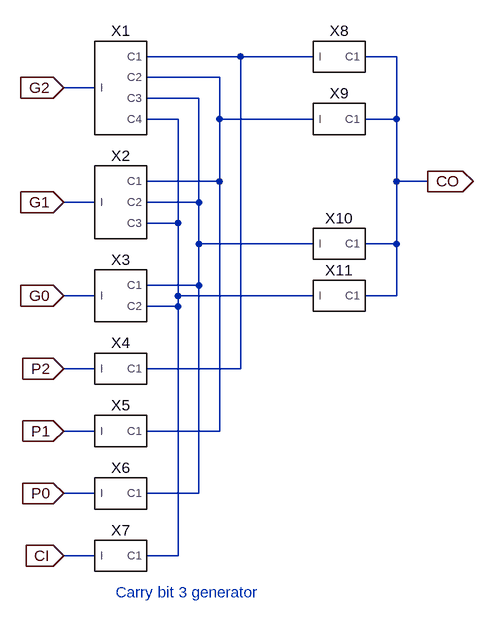
[diagram p0: schematic cla3.asc]
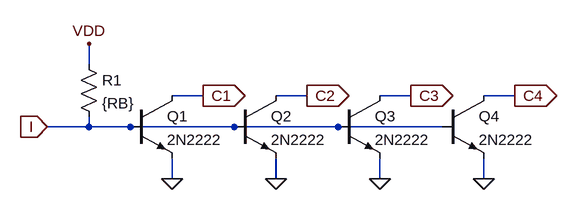
[diagram p1: sub-circuit iilg4.asc]
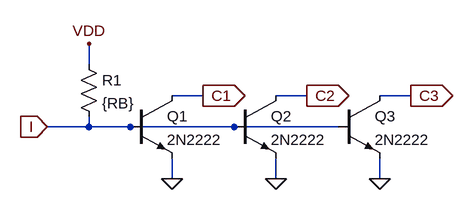
[diagram p2: sub-circuit iilg3.asc]
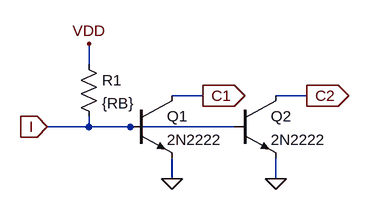
[diagram p3: sub-circuit iilg2.asc]
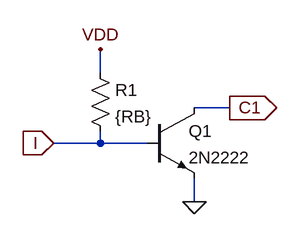
[diagram p4: sub-circuit iilg1.asc]
cla3.asc, the LTspice schematic file:
Version 4
SHEET 1 1200 840
WIRE 432 0 288 0
WIRE 544 0 432 0
WIRE 672 0 624 0
WIRE 400 32 288 32
WIRE 208 48 160 48
WIRE 368 64 288 64
WIRE 336 96 288 96
WIRE 400 96 400 32
WIRE 544 96 400 96
WIRE 672 96 672 0
WIRE 672 96 624 96
WIRE 400 192 400 96
WIRE 400 192 288 192
WIRE 672 192 672 96
WIRE 720 192 672 192
WIRE 208 224 160 224
WIRE 368 224 368 64
WIRE 368 224 288 224
WIRE 336 256 336 96
WIRE 336 256 288 256
WIRE 368 288 368 224
WIRE 544 288 368 288
WIRE 672 288 672 192
WIRE 672 288 624 288
WIRE 368 352 368 288
WIRE 368 352 288 352
WIRE 208 368 160 368
WIRE 336 368 336 256
WIRE 544 368 336 368
WIRE 672 368 672 288
WIRE 672 368 624 368
WIRE 336 384 336 368
WIRE 336 384 288 384
WIRE 208 480 160 480
WIRE 432 480 432 0
WIRE 432 480 288 480
WIRE 208 576 160 576
WIRE 400 576 400 192
WIRE 400 576 288 576
WIRE 208 672 160 672
WIRE 368 672 368 352
WIRE 368 672 288 672
WIRE 208 768 160 768
WIRE 336 768 336 384
WIRE 336 768 288 768
FLAG 160 48 G2
IOPIN 160 48 In
FLAG 160 224 G1
IOPIN 160 224 In
FLAG 160 368 G0
IOPIN 160 368 In
FLAG 160 480 P2
IOPIN 160 480 In
FLAG 160 576 P1
IOPIN 160 576 In
FLAG 160 672 P0
IOPIN 160 672 In
FLAG 160 768 CI
IOPIN 160 768 In
FLAG 720 192 CO
IOPIN 720 192 Out
SYMBOL iilg4 240 48 R0
SYMATTR InstName X1
SYMBOL iilg3 240 224 R0
SYMATTR InstName X2
SYMBOL iilg2 240 368 R0
SYMATTR InstName X3
SYMBOL iilg1 240 480 R0
SYMATTR InstName X4
SYMBOL iilg1 240 576 R0
SYMATTR InstName X5
SYMBOL iilg1 240 672 R0
SYMATTR InstName X6
SYMBOL iilg1 240 768 R0
SYMATTR InstName X7
SYMBOL iilg1 576 0 R0
SYMATTR InstName X8
SYMBOL iilg1 576 96 R0
SYMATTR InstName X9
SYMBOL iilg1 576 288 R0
SYMATTR InstName X10
SYMBOL iilg1 576 368 R0
SYMATTR InstName X11
TEXT 240 824 Left 2 ;Carry bit 3 generator

iilg4.asc, the sub-circuit schematic file:
Version 4
SHEET 1 1132 680
WIRE 384 240 384 208
WIRE 560 288 512 288
WIRE 720 288 672 288
WIRE 880 288 832 288
WIRE 1040 288 992 288
WIRE 384 336 384 320
WIRE 384 336 320 336
WIRE 448 336 384 336
WIRE 608 336 448 336
WIRE 768 336 608 336
WIRE 928 336 768 336
WIRE 512 416 512 384
WIRE 672 416 672 384
WIRE 832 416 832 384
WIRE 992 416 992 384
FLAG 384 208 VDD
FLAG 320 336 I
IOPIN 320 336 In
FLAG 512 416 0
FLAG 560 288 C1
IOPIN 560 288 Out
FLAG 672 416 0
FLAG 720 288 C2
IOPIN 720 288 Out
FLAG 832 416 0
FLAG 880 288 C3
IOPIN 880 288 Out
FLAG 992 416 0
FLAG 1040 288 C4
IOPIN 1040 288 Out
SYMBOL npn 448 288 R0
SYMATTR InstName Q1
SYMATTR Value 2N2222
SYMBOL res 368 224 R0
SYMATTR InstName R1
SYMATTR Value {RB}
SYMBOL npn 608 288 R0
SYMATTR InstName Q2
SYMATTR Value 2N2222
SYMBOL npn 768 288 R0
SYMATTR InstName Q3
SYMATTR Value 2N2222
SYMBOL npn 928 288 R0
SYMATTR InstName Q4
SYMATTR Value 2N2222

iilg3.asc, the sub-circuit schematic file:
Version 4
SHEET 1 956 680
WIRE 384 240 384 208
WIRE 560 288 512 288
WIRE 720 288 672 288
WIRE 880 288 832 288
WIRE 384 336 384 320
WIRE 384 336 320 336
WIRE 448 336 384 336
WIRE 608 336 448 336
WIRE 768 336 608 336
WIRE 512 416 512 384
WIRE 672 416 672 384
WIRE 832 416 832 384
FLAG 384 208 VDD
FLAG 320 336 I
IOPIN 320 336 In
FLAG 512 416 0
FLAG 560 288 C1
IOPIN 560 288 Out
FLAG 672 416 0
FLAG 720 288 C2
IOPIN 720 288 Out
FLAG 832 416 0
FLAG 880 288 C3
IOPIN 880 288 Out
SYMBOL npn 448 288 R0
SYMATTR InstName Q1
SYMATTR Value 2N2222
SYMBOL res 368 224 R0
SYMATTR InstName R1
SYMATTR Value {RB}
SYMBOL npn 608 288 R0
SYMATTR InstName Q2
SYMATTR Value 2N2222
SYMBOL npn 768 288 R0
SYMATTR InstName Q3
SYMATTR Value 2N2222

iilg2.asc, the sub-circuit schematic file:
Version 4
SHEET 1 880 680
WIRE 384 240 384 208
WIRE 560 288 512 288
WIRE 720 288 672 288
WIRE 384 336 384 320
WIRE 384 336 320 336
WIRE 448 336 384 336
WIRE 608 336 448 336
WIRE 512 416 512 384
WIRE 672 416 672 384
FLAG 384 208 VDD
FLAG 320 336 I
IOPIN 320 336 In
FLAG 512 416 0
FLAG 560 288 C1
IOPIN 560 288 Out
FLAG 672 416 0
FLAG 720 288 C2
IOPIN 720 288 Out
SYMBOL npn 448 288 R0
SYMATTR InstName Q1
SYMATTR Value 2N2222
SYMBOL res 368 224 R0
SYMATTR InstName R1
SYMATTR Value {RB}
SYMBOL npn 608 288 R0
SYMATTR InstName Q2
SYMATTR Value 2N2222

iilg1.asc, the sub-circuit schematic file:
Version 4
SHEET 1 880 680
WIRE 384 240 384 208
WIRE 560 288 512 288
WIRE 384 336 384 320
WIRE 384 336 320 336
WIRE 448 336 384 336
WIRE 512 416 512 384
FLAG 512 416 0
FLAG 384 208 VDD
FLAG 320 336 I
IOPIN 320 336 In
FLAG 560 288 C1
IOPIN 560 288 Out
SYMBOL npn 448 288 R0
SYMATTR InstName Q1
SYMATTR Value 2N2222
SYMBOL res 368 224 R0
SYMATTR InstName R1
SYMATTR Value {RB}

The netlist it stands for:
* cla3.asc
XX1 G2 N001 N002 N003 N004 iilg4
XX2 G1 N002 N003 N004 iilg3
XX3 G0 N003 N004 iilg2
XX4 P2 N001 iilg1
XX5 P1 N002 iilg1
XX6 P0 N003 iilg1
XX7 CI N004 iilg1
XX8 N001 CO iilg1
XX9 N002 CO iilg1
XX10 N003 CO iilg1
XX11 N004 CO iilg1

* block symbol definitions
.subckt iilg4 I C1 C2 C3 C4
Q1 C1 I 0 0 2N2222
R1 VDD I {RB}
Q2 C2 I 0 0 2N2222
Q3 C3 I 0 0 2N2222
Q4 C4 I 0 0 2N2222
.ends iilg4

.subckt iilg3 I C1 C2 C3
Q1 C1 I 0 0 2N2222
R1 VDD I {RB}
Q2 C2 I 0 0 2N2222
Q3 C3 I 0 0 2N2222
.ends iilg3

.subckt iilg2 I C1 C2
Q1 C1 I 0 0 2N2222
R1 VDD I {RB}
Q2 C2 I 0 0 2N2222
.ends iilg2

.subckt iilg1 I C1
Q1 C1 I 0 0 2N2222
R1 VDD I {RB}
.ends iilg1

.model NPN NPN
.model PNP PNP
.lib standard.bjt
* Carry bit 3 generator
.backanno
.end